# Altium schematic sheet IRGenerator.SchDoc
size A4
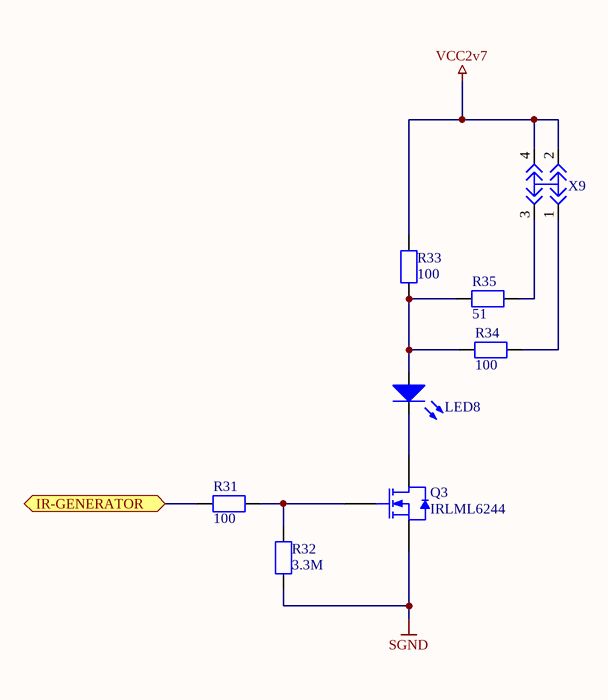
[diagram p0: IRGenerator.SchDoc]

## Parts
LED8  L53F3C  [LED-5-SHORT-LEGS]  (value not drawn)
Q3  IRLML6244  [SOT23_N]
R31  value 100  [R0805]  (hidden comment: R100-5%)
R32  value 3.3M  [R0805]  (hidden comment: R3.3M-5%)
R33  value 100  [R1206]  (hidden comment: R100-5%)
R34  value 100  [R1206]  (hidden comment: R100-5%)
R35  value 51  [R1206]  (hidden comment: R51-5%)
X9  JUMPER-PLD-POWER-0-1-2  [PLD-POWER-1-2-3]  (value not drawn)

## Ports
IR-GENERATOR

## Nets
SGND: Q3.2(S) R32.2
VCC2v7: R33.2 X9.2 X9.4
IR-GENERATOR: R31.1 ; port IR-GENERATOR
NetLED8_1: LED8.1(A) R33.1 R34.2 R35.2
NetLED8_2: LED8.2(K) Q3.3(D)
NetQ3_1: Q3.1(G) R31.2 R32.1
NetR34_1: R34.1 X9.1
NetR35_1: R35.1 X9.3

## Library data of the parts
LED8 = L53F3C: IR LED; Type: Светодиод; Color: IR; Name: L53F3C
Q3 = IRLML6244: N-Channel Power MOSFET; Type: MOSFET N-канал; Id: 6.3A; Vgs: 0.5-11V; Vds: 20V; Name: IRLML6244
R31 R33 R34 = R100-5%: R-100-5%; Precision: 5%; Type: Резистор; Name: R100-5%
R32 = R3.3M-5%: Precision: 5%; Type: Резистор; Name: R3.3M-5%
R35 = R51-5%: R-51-5%; Precision: 5%; Type: Резистор; Name: R51-5%
X9 = JUMPER-PLD-POWER-0-1-2: Name: JUMPER-PLD-POWER-0-1-2; Type: Линейка джамперов